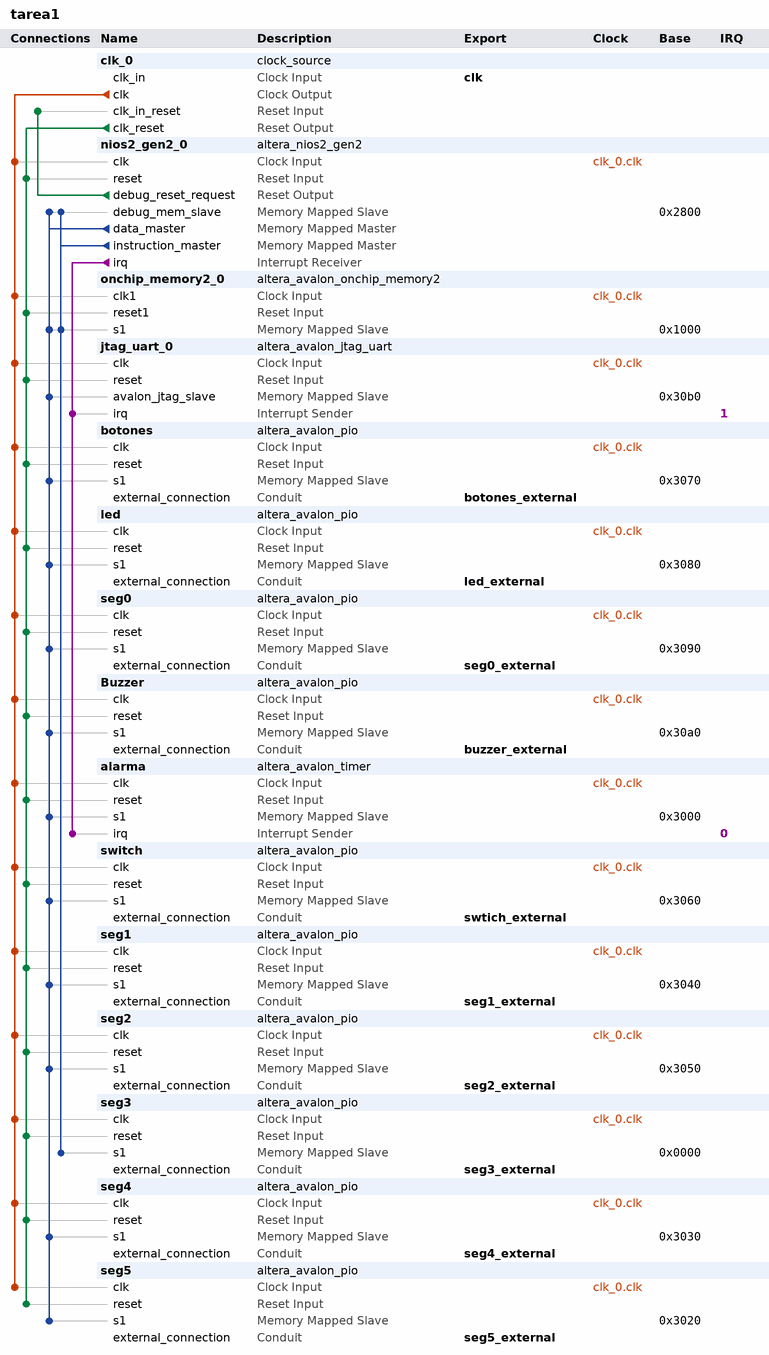
[diagram p0: system contents]
# Platform Designer (Qsys) system tarea1, Cyclone V 5CSXFC6D6F31C6
# Parameters at their usual value, and those the tool derives, are not listed.
package require -exact qsys 18.1
create_system tarea1
set_project_property DEVICE_FAMILY {Cyclone V}
set_project_property DEVICE 5CSXFC6D6F31C6

add_instance clk_0 clock_source 18.1
set_instance_parameter_value clk_0 clockFrequency 50000000

add_instance nios2_gen2_0 altera_nios2_gen2 18.1
set_instance_parameter_value nios2_gen2_0 dcache_size 2048
set_instance_parameter_value nios2_gen2_0 exceptionSlave onchip_memory2_0.s1
set_instance_parameter_value nios2_gen2_0 icache_size 4096
set_instance_parameter_value nios2_gen2_0 impl Fast
set_instance_parameter_value nios2_gen2_0 resetSlave onchip_memory2_0.s1

add_instance onchip_memory2_0 altera_avalon_onchip_memory2 18.1
set_instance_parameter_value onchip_memory2_0 dataWidth 32
set_instance_parameter_value onchip_memory2_0 dualPort false
set_instance_parameter_value onchip_memory2_0 initMemContent true
set_instance_parameter_value onchip_memory2_0 initializationFileName onchip_mem.hex
set_instance_parameter_value onchip_memory2_0 memorySize 4096

add_instance jtag_uart_0 altera_avalon_jtag_uart 18.1
set_instance_parameter_value jtag_uart_0 simInteractiveOptions NO_INTERACTIVE_WINDOWS

add_instance botones altera_avalon_pio 18.1
set_instance_parameter_value botones direction Input
set_instance_parameter_value botones width 4

add_instance led altera_avalon_pio 18.1
set_instance_parameter_value led direction Output
set_instance_parameter_value led width 3

add_instance seg0 altera_avalon_pio 18.1
set_instance_parameter_value seg0 direction Output
set_instance_parameter_value seg0 width 7

add_instance Buzzer altera_avalon_pio 18.1
set_instance_parameter_value Buzzer direction Output
set_instance_parameter_value Buzzer width 1

add_instance alarma altera_avalon_timer 18.1
set_instance_parameter_value alarma period 1
set_instance_parameter_value alarma periodUnits SEC

add_instance switch altera_avalon_pio 18.1
set_instance_parameter_value switch direction Input
set_instance_parameter_value switch width 4

add_instance seg1 altera_avalon_pio 18.1
set_instance_parameter_value seg1 direction Output
set_instance_parameter_value seg1 width 7

add_instance seg2 altera_avalon_pio 18.1
set_instance_parameter_value seg2 direction Output
set_instance_parameter_value seg2 width 7

add_instance seg3 altera_avalon_pio 18.1
set_instance_parameter_value seg3 direction Output
set_instance_parameter_value seg3 width 7

add_instance seg4 altera_avalon_pio 18.1
set_instance_parameter_value seg4 direction Output
set_instance_parameter_value seg4 width 7

add_instance seg5 altera_avalon_pio 18.1
set_instance_parameter_value seg5 direction Output
set_instance_parameter_value seg5 width 7

# connections
add_connection clk_0.clk alarma.clk clock
add_connection clk_0.clk botones.clk clock
add_connection clk_0.clk Buzzer.clk clock
add_connection clk_0.clk jtag_uart_0.clk clock
add_connection clk_0.clk led.clk clock
add_connection clk_0.clk nios2_gen2_0.clk clock
add_connection clk_0.clk onchip_memory2_0.clk1 clock
add_connection clk_0.clk seg0.clk clock
add_connection clk_0.clk seg1.clk clock
add_connection clk_0.clk seg2.clk clock
add_connection clk_0.clk seg3.clk clock
add_connection clk_0.clk seg4.clk clock
add_connection clk_0.clk seg5.clk clock
add_connection clk_0.clk switch.clk clock
add_connection clk_0.clk_reset alarma.reset reset
add_connection clk_0.clk_reset botones.reset reset
add_connection clk_0.clk_reset Buzzer.reset reset
add_connection clk_0.clk_reset jtag_uart_0.reset reset
add_connection clk_0.clk_reset led.reset reset
add_connection clk_0.clk_reset nios2_gen2_0.reset reset
add_connection clk_0.clk_reset onchip_memory2_0.reset1 reset
add_connection clk_0.clk_reset seg0.reset reset
add_connection clk_0.clk_reset seg1.reset reset
add_connection clk_0.clk_reset seg2.reset reset
add_connection clk_0.clk_reset seg3.reset reset
add_connection clk_0.clk_reset seg4.reset reset
add_connection clk_0.clk_reset seg5.reset reset
add_connection clk_0.clk_reset switch.reset reset
add_connection nios2_gen2_0.debug_reset_request clk_0.clk_in_reset reset
add_connection nios2_gen2_0.data_master alarma.s1 avalon
set_connection_parameter_value nios2_gen2_0.data_master/alarma.s1 baseAddress 0x3000
add_connection nios2_gen2_0.data_master botones.s1 avalon
set_connection_parameter_value nios2_gen2_0.data_master/botones.s1 baseAddress 0x3070
add_connection nios2_gen2_0.data_master Buzzer.s1 avalon
set_connection_parameter_value nios2_gen2_0.data_master/Buzzer.s1 baseAddress 0x30a0
add_connection nios2_gen2_0.data_master jtag_uart_0.avalon_jtag_slave avalon
set_connection_parameter_value nios2_gen2_0.data_master/jtag_uart_0.avalon_jtag_slave baseAddress 0x30b0
add_connection nios2_gen2_0.data_master led.s1 avalon
set_connection_parameter_value nios2_gen2_0.data_master/led.s1 baseAddress 0x3080
add_connection nios2_gen2_0.data_master nios2_gen2_0.debug_mem_slave avalon
set_connection_parameter_value nios2_gen2_0.data_master/nios2_gen2_0.debug_mem_slave baseAddress 0x2800
add_connection nios2_gen2_0.data_master onchip_memory2_0.s1 avalon
set_connection_parameter_value nios2_gen2_0.data_master/onchip_memory2_0.s1 baseAddress 0x1000
add_connection nios2_gen2_0.data_master seg0.s1 avalon
set_connection_parameter_value nios2_gen2_0.data_master/seg0.s1 baseAddress 0x3090
add_connection nios2_gen2_0.data_master seg1.s1 avalon
set_connection_parameter_value nios2_gen2_0.data_master/seg1.s1 baseAddress 0x3040
add_connection nios2_gen2_0.data_master seg2.s1 avalon
set_connection_parameter_value nios2_gen2_0.data_master/seg2.s1 baseAddress 0x3050
add_connection nios2_gen2_0.data_master seg4.s1 avalon
set_connection_parameter_value nios2_gen2_0.data_master/seg4.s1 baseAddress 0x3030
add_connection nios2_gen2_0.data_master seg5.s1 avalon
set_connection_parameter_value nios2_gen2_0.data_master/seg5.s1 baseAddress 0x3020
add_connection nios2_gen2_0.data_master switch.s1 avalon
set_connection_parameter_value nios2_gen2_0.data_master/switch.s1 baseAddress 0x3060
add_connection nios2_gen2_0.instruction_master nios2_gen2_0.debug_mem_slave avalon
set_connection_parameter_value nios2_gen2_0.instruction_master/nios2_gen2_0.debug_mem_slave baseAddress 0x2800
add_connection nios2_gen2_0.instruction_master onchip_memory2_0.s1 avalon
set_connection_parameter_value nios2_gen2_0.instruction_master/onchip_memory2_0.s1 baseAddress 0x1000
add_connection nios2_gen2_0.instruction_master seg3.s1 avalon
set_connection_parameter_value nios2_gen2_0.instruction_master/seg3.s1 baseAddress 0x0000
add_connection nios2_gen2_0.irq alarma.irq interrupt
set_connection_parameter_value nios2_gen2_0.irq/alarma.irq irqNumber 0
add_connection nios2_gen2_0.irq jtag_uart_0.irq interrupt
set_connection_parameter_value nios2_gen2_0.irq/jtag_uart_0.irq irqNumber 1

# exported interfaces
add_interface botones_external conduit end
set_interface_property botones_external EXPORT_OF botones.external_connection
add_interface buzzer_external conduit end
set_interface_property buzzer_external EXPORT_OF Buzzer.external_connection
add_interface clk clock sink
set_interface_property clk EXPORT_OF clk_0.clk_in
add_interface led_external conduit end
set_interface_property led_external EXPORT_OF led.external_connection
add_interface seg0_external conduit end
set_interface_property seg0_external EXPORT_OF seg0.external_connection
add_interface seg1_external conduit end
set_interface_property seg1_external EXPORT_OF seg1.external_connection
add_interface seg2_external conduit end
set_interface_property seg2_external EXPORT_OF seg2.external_connection
add_interface seg3_external conduit end
set_interface_property seg3_external EXPORT_OF seg3.external_connection
add_interface seg4_external conduit end
set_interface_property seg4_external EXPORT_OF seg4.external_connection
add_interface seg5_external conduit end
set_interface_property seg5_external EXPORT_OF seg5.external_connection
add_interface swtich_external conduit end
set_interface_property swtich_external EXPORT_OF switch.external_connection

set_interconnect_requirement {$system} qsys_mm.clockCrossingAdapter HANDSHAKE
set_interconnect_requirement {$system} qsys_mm.enableEccProtection FALSE
set_interconnect_requirement {$system} qsys_mm.insertDefaultSlave FALSE
set_interconnect_requirement {$system} qsys_mm.maxAdditionalLatency 1

save_system tarea1.qsys
